# Altium schematic sheet 24_Interruptores_Alimentacion.SchDoc
size A4; SheetNumber: 10; SheetTotal: 21
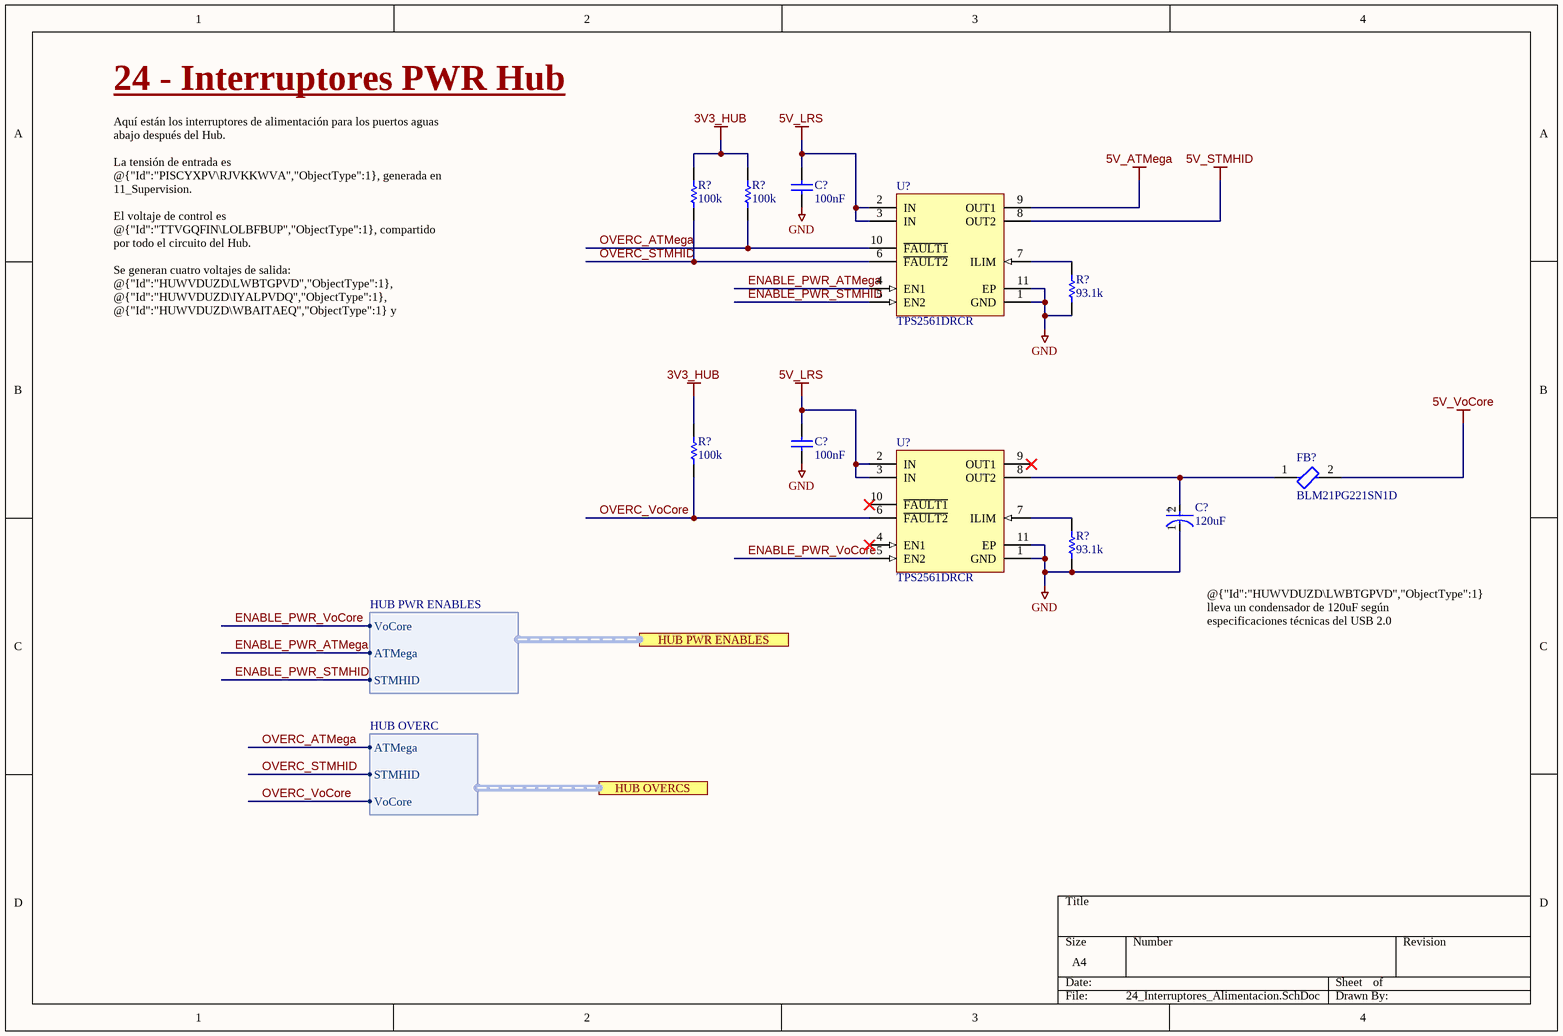
[diagram p0: 24_Interruptores_Alimentacion.SchDoc]

## Parts
(Parts that share a designator on the sheet are numbered #1, #2 ... from top to bottom, then left to right.)
C?#1  100nF  [CAPC1005X55X25NL05T05]
C?#2  100nF  [CAPC1005X55X25NL05T05]
C?#3  120uF  [FP-OS-CON-SMT-F12-MFG]
FB?  BLM21PG221SN1D  [FP-BLM21-0_2-t0_85-e0_5-IPC_B]
R?#1  100k  [RESC1005X40X25ML10T10]
R?#2  100k  [RESC1005X40X25ML10T10]
R?#3  93.1k  [RESC0603X28X15ML05T05]
R?#4  100k  [RESC1005X40X25ML10T10]
R?#5  93.1k  [RESC0603X28X15ML05T05]
U?#1  TPS2561DRCR  [DRC0010A_V]
U?#2  TPS2561DRCR  [DRC0010A_V]

## Ports
HUB OVERCS (harness HUB OVERC), HUB PWR ENABLES (harness HUB PWR ENABLES)

## Harnesses
HUB PWR ENABLES: ATMega, STMHID, VoCore
HUB OVERC: ATMega, STMHID, VoCore

## Nets
3V3_HUB: R?#1.2 R?#2.2 R?#4.2
5V_ATMega: U?#1.9(OUT1)
5V_LRS: C?#1.2 C?#2.2 U?#1.2(IN) U?#1.3(IN) U?#2.2(IN) U?#2.3(IN)
5V_STMHID: U?#1.8(OUT2)
5V_VoCore: FB?.2
GND: C?#1.1 C?#2.1 C?#3.1(C) R?#3.1 R?#5.1 U?#1.1(GND) U?#1.11(EP) U?#2.1(GND) U?#2.11(EP)
ENABLE_PWR_ATMega: U?#1.4(EN1) ; port HUB PWR ENABLES.ATMega
ENABLE_PWR_STMHID: U?#1.5(EN2) ; port HUB PWR ENABLES.STMHID
ENABLE_PWR_VoCore: U?#2.5(EN2) ; port HUB PWR ENABLES.VoCore
OVERC_ATMega: R?#2.1 U?#1.10(~{FAULT1}) ; port HUB OVERCS.ATMega
OVERC_STMHID: R?#1.1 U?#1.6(~{FAULT2}) ; port HUB OVERCS.STMHID
OVERC_VoCore: R?#4.1 U?#2.6(~{FAULT2}) ; port HUB OVERCS.VoCore
NetC?#3_2: C?#3.2(A) FB?.1 U?#2.8(OUT2)
NetR?#3_2: R?#3.2 U?#1.7(ILIM)
NetR?#5_2: R?#5.2 U?#2.7(ILIM)

Not connected (* = marked no-connect by the designer): U?#2 4(EN1)* 9(OUT1)* 10(~{FAULT1})*

## Notes on the sheet
- 24 - Interruptores PWR Hub
- Aquí están los interruptores de alimentación para los puertos aguas abajo después del Hub.
  La tensión de entrada es @{"Id":"PISCYXPV\RJVKKWVA","ObjectType":1}, generada en 11_Supervision.
  El voltaje de control es @{"Id":"TTVGQFIN\LOLBFBUP","ObjectType":1}, compartido por todo el circuito del Hub.
  Se generan cuatro voltajes de salida: @{"Id":"HUWVDUZD\LWBTGPVD","ObjectType":1}, @{"Id":"HUWVDUZD\IYALPVDQ","ObjectType":1}, @{"Id":"HUWVDUZD\WBAITAEQ","ObjectType":1} y @{"Id":"HUWVDUZD\QBNLNCHJ","ObjectType":1}.
- @{"Id":"HUWVDUZD\LWBTGPVD","ObjectType":1} lleva un condensador de 120uF según especificaciones técnicas del USB 2.0
- (in symbol CMP-05428-001337-1) +

## Library data of the parts
C?#1 C?#2 = CMP-2008-02030-1: Manufacturer: Vitramon; Part Number: VJ0402Y104KXJCW1BC
C?#3 = CMP-05428-001337-1: Conductive Polymer Aluminum Solid Capacitors (OS-CON) 120uF ±20% 50V RADIAL SMT 10x12.6mm; ESR (Equivalent Series Resistance): 20mR; Life (Hours): 1000Hour; Case/Package: Radial; Packaging: Cut Tape; Series: OS-CON™, SVPK; Voltage Rating: 50V; Tolerance: 20%; Min Operating Temperature: -55°C; Mount: Surface Mount; RoHS Compliant: Yes; Max Operating Temperature: 125°C; Capacitance: 120uF
FB? = CMP-0686-00610-3: Chip Ferrite Bead, 0805, 220Ω @ 100MHz, 0.045Ω, 25%, 2A; Number of Circuits: 1; Shielding: Unshielded; DC Resistance (DCR): 45mR; Impedance: 220R; Radiation Hardening: No; Material: Ferrite; Frequency: 100MHz; Width: 1.25mm; DC Current: 2A; Max DC Current: 2A; Number of Lines: 1; Package Quantity: 1; Case Code (Metric): 2012; Current Rating: 2A; Case/Package: 0805; Current: 2A; Military Standard: Not; Core Material: Ferrite; Depth: 1.25mm; Contact Plating: Tin; DC Resistance-Max: 45mR; Max Operating Temperature: 125°C; Length: 2mm; Max Current Rating: 2A; REACH SVHC: No SVHC; Termination: SMD/SMT; Min Operating Temperature: -55°C; Series: BLM21P; Test Frequency: 100MHz; Tolerance: 25%; Number of Pins: 2; RoHS Compliant: Yes; Height: 0.85mm; Packaging: Tape and Reel; Lead Free: Lead Free; Case Code (Imperial): 0805
R?#1 R?#2 R?#4 = CMP-2002-04583-1: Part Number: SG73P1ETTP1003F; Manufacturer: KOA Speer
R?#3 R?#5 = CMP-2004-00947-1: Part Number: CRCW020193K1FKED; Manufacturer: Vishay Dale
U?#1 U?#2 = CMP-0337-00192-2: Dual Channel Precision Adjustable Current-Limited Power Switch, 0.25 to 2.5 A Current Limit, -40 to 85 degC, 10-pin SON (DRC), Green (RoHS & no Sb/Br); Manufacturer: Texas Instruments; Rating: Catalog; Vin(Min)(V): 2.5; Current Limit Topology: Constant-Current; rDS(on) per FET(Typ)(mOhms): 45; Enable: Active High; Vin(Max)(V): 6.5; Current Limit Accuracy @ 1A: +/-7.5% (2590mA min / 3005mA max); Number of Switches: 2; Current Limit(A): 0.25 - 2.5; PackageDescription: 10-Pin Plastic Small Outline No-Lead, 3 x 3 x 1 mm Body, 0.5 mm Pitch, Exposed Pad; PackageVersion: revL, Sep-2011; Eco-Plan: Green (RoHS & no Sb/Br); PartNumber: TPS2561DRCR; PackageReference: DRC0010A; Mounting Technology: Surface Mount; ComponentLink1URL: http://www.ti.com/general/docs/lit/getliterature.tsp?genericPartNumber=TPS2561&fileType=pdf; DatasheetVersion: SLVS930A; Continuous Current(Max)(A): 2.5; ComponentLink1Description: Datasheet